# EAGLE design SOIC16 breakout (EAGLE 8.3.2)
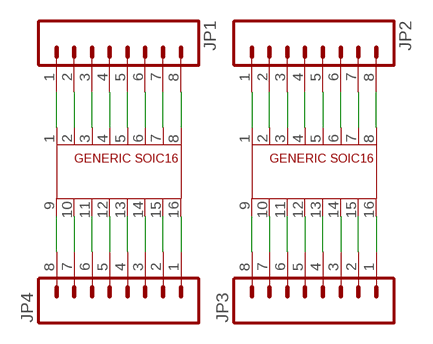
[diagram p0: schematic, sheet 1]

## Parts
JP1  M08  [1X08]
JP2  M08  [1X08]
JP3  M08  [1X08]
JP4  M08  [1X08]
U$1  SOIC16  [SOIC-16]
U$2  SOIC16  [SOIC-16]

## Nets
N$1: JP1.1 U$1.1
N$2: JP1.2 U$1.2
N$3: JP1.3 U$1.3
N$4: JP1.4 U$1.4
N$5: JP1.5 U$1.5
N$6: JP1.6 U$1.6
N$7: JP1.7 U$1.7
N$8: JP1.8 U$1.8
N$9: JP2.1 U$2.1
N$10: JP2.2 U$2.2
N$11: JP2.3 U$2.3
N$12: JP2.4 U$2.4
N$13: JP2.5 U$2.5
N$14: JP2.6 U$2.6
N$15: JP2.7 U$2.7
N$16: JP2.8 U$2.8
N$17: JP3.1 U$2.16
N$18: JP3.2 U$2.15
N$19: JP3.3 U$2.14
N$20: JP3.4 U$2.13
N$21: JP3.5 U$2.12
N$22: JP3.6 U$2.11
N$23: JP3.7 U$2.10
N$24: JP3.8 U$2.9
N$25: JP4.1 U$1.16
N$26: JP4.2 U$1.15
N$27: JP4.3 U$1.14
N$28: JP4.4 U$1.13
N$29: JP4.5 U$1.12
N$30: JP4.6 U$1.11
N$31: JP4.7 U$1.10
N$32: JP4.8 U$1.9

## Library data of the parts
JP1-JP4 = HyTechDevices:M08: Standard 8-pin 0.1" header. NOTES ON THE VARIANTS LOCK and LOCK_LONGPADS... This footprint was designed to help hold the alignment of a through-hole component (i.e. 6-pin header) while soldering it into place. You may notice that each hole has been shifted either up or down by 0.005 of an inch from it's more standard position (which is a perfectly straight line). This slight alteration caused the pins (the squares in the middle) to touch the edges of the holes. Because they are alternating, it causes a "brace" to hold the component in place. 0.005 has proven to be the perfect amount of "off-center" position when using our standard breakaway headers. Although looks a little odd when you look at the bare footprint, once you have a header in there, the alteration is very hard to notice. Also,if you push a header all the way into place, it is covered up entirely on the bottom side. This idea of altering the position of holes to aid alignment will be further integrated into the Sparkfun Library for other footprints. It can help hold any component with 3 or more connection pins. Note: The Sparkfun version includes many other packages including surface mount that may be of future interest. Source: Sparkfun <https://github.com/sparkfun/SparkFun-Eagle-Libraries>
U$1 U$2 = HyTechDevices:SOIC16

## Board
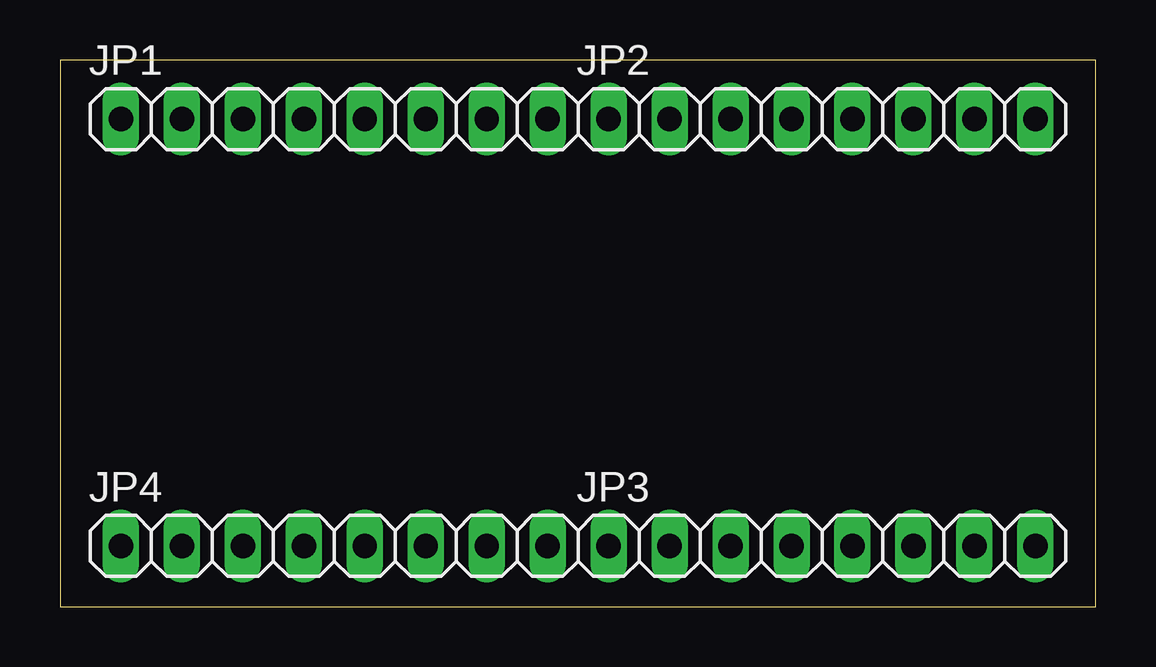
[diagram p1: board, top side]
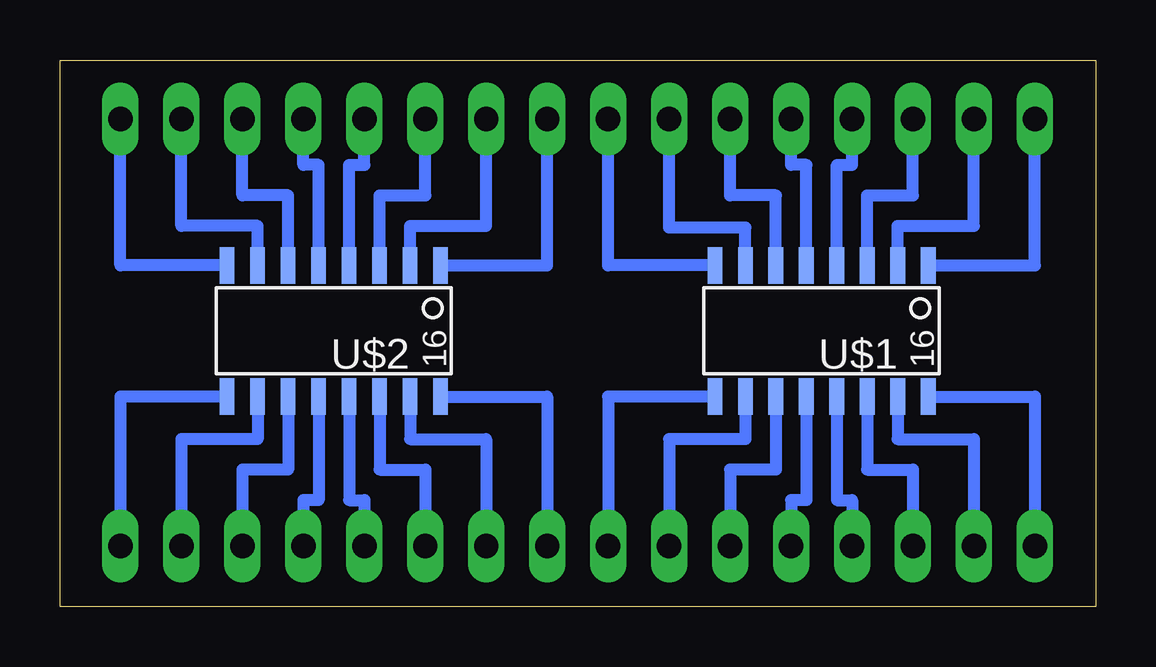
[diagram p2: board, bottom side, seen from below]

Size 43.16 x 22.78 mm. Coordinates in mm from the lower left corner, seen from the top.
Outline: 0,0 43.16,0 43.16,22.78 0,22.78 0,0
Copper layers (1*16): Top 0.035mm / dielectric 1.5mm / Bottom 0.035mm
Design rules "default": minimum track width 10mil, minimum drill 24mil, track to track 8mil, track to pad 8mil, pad to pad 8mil, via to via 8mil, smd to smd 8mil, copper to edge 40mil, drill to drill 8mil, minimum pad ring 10mil, minimum via ring 8mil, stop-mask expansion 4mil, vias tented up to drill 0mil, thermal gap 10mil

### Footprints (pad centres in the part's own frame; a part is rotated, then mirrored left to right if it is on the bottom)
1X08 = drill 1.016 long: 1 -8.89,0; 2 -6.35,0; 3 -3.81,0; 4 -1.27,0; 5 1.27,0; 6 3.81,0; 7 6.35,0; 8 8.89,0
SOIC-16 = smd 0.61 x 1.524: 1 -4.445,-2.794; 2 -3.175,-2.794; 3 -1.905,-2.794; 4 -0.635,-2.794; 5 0.635,-2.794; 6 1.905,-2.794; 7 3.175,-2.794; 8 4.445,-2.794; 9 4.445,2.667; 10 3.175,2.667; 11 1.905,2.667; 12 0.635,2.667; 13 -0.635,2.667; 14 -1.905,2.667; 15 -3.175,2.667; 16 -4.445,2.667

### Placement (x,y rotation side)
JP1  11.43,20.32 0 top
JP2  31.75,20.32 0 top
JP3  31.75,2.54 0 top
JP4  11.43,2.54 0 top
U$1  11.43,11.43 180 bottom
U$2  31.75,11.43 180 bottom

### Tracks (layer width: path | path; a pad name or v marks a point on that pad's centre or on a via)
N$1
  Bottom 0.508: U$1.1 2.54,14.22 JP1.1
N$2
  Bottom 0.508: U$1.2 8.25,15.88 5.08,15.88 JP1.2
N$3
  Bottom 0.508: U$1.3 9.52,17.14 7.62,17.14 JP1.3
N$4
  Bottom 0.508: U$1.4 10.8,18.41 10.16,18.41 JP1.4
N$5
  Bottom 0.508: U$1.5 12.07,18.41 12.7,18.41 JP1.5
N$6
  Bottom 0.508: U$1.6 13.34,17.14 15.24,17.14 JP1.6
N$7
  Bottom 0.508: U$1.7 14.61,15.8 17.78,15.8 JP1.7
N$8
  Bottom 0.508: U$1.8 20.32,14.22 JP1.8
N$9
  Bottom 0.508: U$2.1 22.86,14.22 JP2.1
N$10
  Bottom 0.508: U$2.2 28.57,15.88 25.4,15.88 JP2.2
N$11
  Bottom 0.508: U$2.3 29.84,17.14 27.94,17.14 JP2.3
N$12
  Bottom 0.508: U$2.4 31.12,18.41 30.48,18.41 JP2.4
N$13
  Bottom 0.508: U$2.5 32.38,18.41 33.02,18.41 JP2.5
N$14
  Bottom 0.508: U$2.6 33.66,17.14 35.56,17.14 JP2.6
N$15
  Bottom 0.508: U$2.7 34.93,15.88 38.1,15.88 JP2.7
N$16
  Bottom 0.508: U$2.8 40.64,14.22 JP2.8
N$17
  Bottom 0.508: U$2.16 22.86,8.76 JP3.1
N$18
  Bottom 0.508: U$2.15 28.57,6.99 25.4,6.99 JP3.2
N$19
  Bottom 0.508: U$2.14 29.84,5.71 27.94,5.71 JP3.3
N$20
  Bottom 0.508: U$2.13 31.12,4.45 30.48,4.45 JP3.4
N$21
  Bottom 0.508: U$2.12 32.38,4.45 33.02,4.45 JP3.5
N$22
  Bottom 0.508: U$2.11 33.66,5.71 35.56,5.71 JP3.6
N$23
  Bottom 0.508: U$2.10 34.93,6.99 38.1,6.99 JP3.7
N$24
  Bottom 0.508: U$2.9 40.64,8.76 JP3.8
N$25
  Bottom 0.508: U$1.16 2.54,8.76 JP4.1
N$26
  Bottom 0.508: U$1.15 8.25,6.99 5.08,6.99 JP4.2
N$27
  Bottom 0.508: U$1.14 9.52,5.71 7.62,5.71 JP4.3
N$28
  Bottom 0.508: U$1.13 10.8,4.45 10.16,4.45 JP4.4
N$29
  Bottom 0.508: U$1.12 12.07,4.45 12.7,4.45 JP4.5
N$30
  Bottom 0.508: U$1.11 13.34,5.71 15.24,5.71 JP4.6
N$31
  Bottom 0.508: U$1.10 14.61,6.99 17.78,6.99 JP4.7
N$32
  Bottom 0.508: U$1.9 20.32,8.76 JP4.8